# Altium schematic sheet CON_MEZZANINE_GPIO.SchDoc: Mezzanine con GPIO
size 420 x 297 mm; Author: P. Zdunek; DrawnBy: P. Zdunek; Organization: Altium Limited; Address1: L3, 12a Rodborough Rd; Address2: Frenchs Forest; Address3: NSW; Address4: Australia 2086; DocumentNumber: 23; SheetNumber: 23; SheetTotal: 37; ModifiedBy: -; CheckedDate: -; Title2: Fast Stabilizer; DivGrp: WUT ISE; Designer: G.Kasprowicz
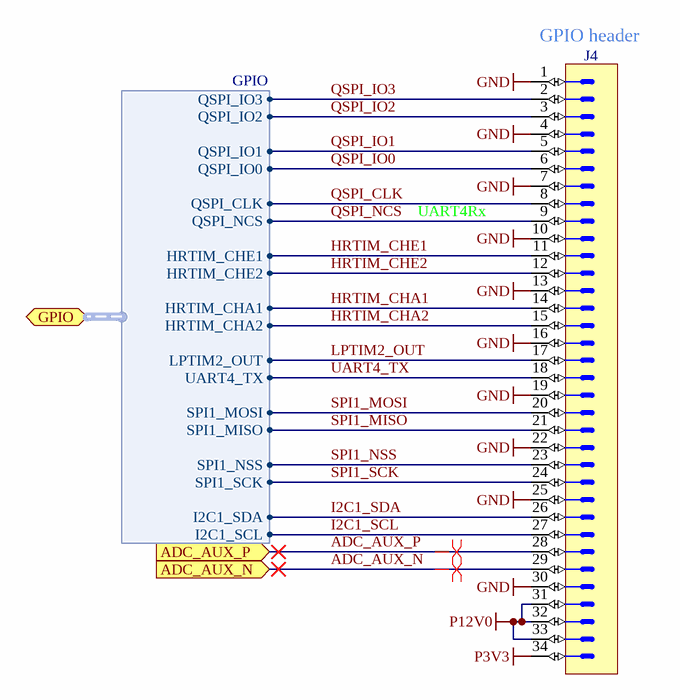
[diagram p0: CON_MEZZANINE_GPIO.SchDoc]

## Parts
J4  Header 34  [3M_N2534-6002RB]  (value not drawn)

## Ports
ADC_AUX_N (in), ADC_AUX_P (in), GPIO (bidir, harness GPIO)

## Harnesses
GPIO: QSPI_IO3, QSPI_IO2, QSPI_IO1, QSPI_IO0, QSPI_CLK, QSPI_NCS, HRTIM_CHE1, HRTIM_CHE2, HRTIM_CHA1, HRTIM_CHA2, LPTIM2_OUT, UART4_TX, SPI1_MOSI, SPI1_MISO, SPI1_NSS, SPI1_SCK, I2C1_SDA, I2C1_SCL

## Nets
GND: J4.1 J4.4 J4.7 J4.10 J4.13 J4.16 J4.19 J4.22 J4.25 J4.30
P3V3: J4.34
P12V0: J4.31 J4.32 J4.33
ADC_AUX_N: J4.29 ; port ADC_AUX_N
ADC_AUX_P: J4.28 ; port ADC_AUX_P
HRTIM_CHA1: J4.14 ; port GPIO.HRTIM_CHA1
HRTIM_CHA2: J4.15 ; port GPIO.HRTIM_CHA2
HRTIM_CHE1: J4.11 ; port GPIO.HRTIM_CHE1
HRTIM_CHE2: J4.12 ; port GPIO.HRTIM_CHE2
I2C1_SCL: J4.27 ; port GPIO.I2C1_SCL
I2C1_SDA: J4.26 ; port GPIO.I2C1_SDA
LPTIM2_OUT: J4.17 ; port GPIO.LPTIM2_OUT
QSPI_CLK: J4.8 ; port GPIO.QSPI_CLK
QSPI_IO0: J4.6 ; port GPIO.QSPI_IO0
QSPI_IO1: J4.5 ; port GPIO.QSPI_IO1
QSPI_IO2: J4.3 ; port GPIO.QSPI_IO2
QSPI_IO3: J4.2 ; port GPIO.QSPI_IO3
QSPI_NCS: J4.9 ; port GPIO.QSPI_NCS
SPI1_MISO: J4.21 ; port GPIO.SPI1_MISO
SPI1_MOSI: J4.20 ; port GPIO.SPI1_MOSI
SPI1_NSS: J4.23 ; port GPIO.SPI1_NSS
SPI1_SCK: J4.24 ; port GPIO.SPI1_SCK
UART4_TX: J4.18 ; port GPIO.UART4_TX

## Layout directives
differential pair: ADC_AUX_N, ADC_AUX_P

## Notes on the sheet
- (near J4) GPIO header
- UART4Rx
- Project/Equipment
- Document
- Designer
- Drawn by
- Check.by
- Copyright WUT ISE 2020.
  This documentation describes Open Hardware and is licensed under the CERN OHL v.1.2. You may redistribute and modify this documentation under the terms of the CERN OHL v.1.2. (http://ohwr.org/CERNOHL). This documentation is distributed WITHOUT ANY EXPRESS OR IMPLIED WARRANTY, INCLUDING OF MERCHANTABILITY, SATISFACTORY QUALITY AND FITNESS FOR A PARTICULAR PURPOSE. Please see the CERN OHL v.1.2 for applicable conditions.
- Contact
- File
- Last Mod.
- Print Date
- Sheet
- Size
- A3
- of
- Rev

## Library data of the parts
J4 = 3M_N2534-6002RB: Connector 34 Male; Part Description: 34 Contacts - Straight .100'' x .100'' Low Profile Four-Wall Header, 2500 Series; Manufacturer: 3M; PressFit: No; Part Number: 3M_N2534-6002RB; Component Kind: Standard; Component Type: Standard; Pin Count: 34; Family: Header 34; Mounted: Yes; Socket: No; SMD: No; Sense: No; Status: None; Manufacturer Part Number: N2534-6002RB; ComponentHeight: 10.03mm; HelpURL: \\cern.ch\dfs\Applications\Altium\Datasheets\3M_N2534-6002RB.pdf; Author: CERN DEM JLC; CreateDate: 11.02.2009; LatestRevisionDate: 11.08.2009